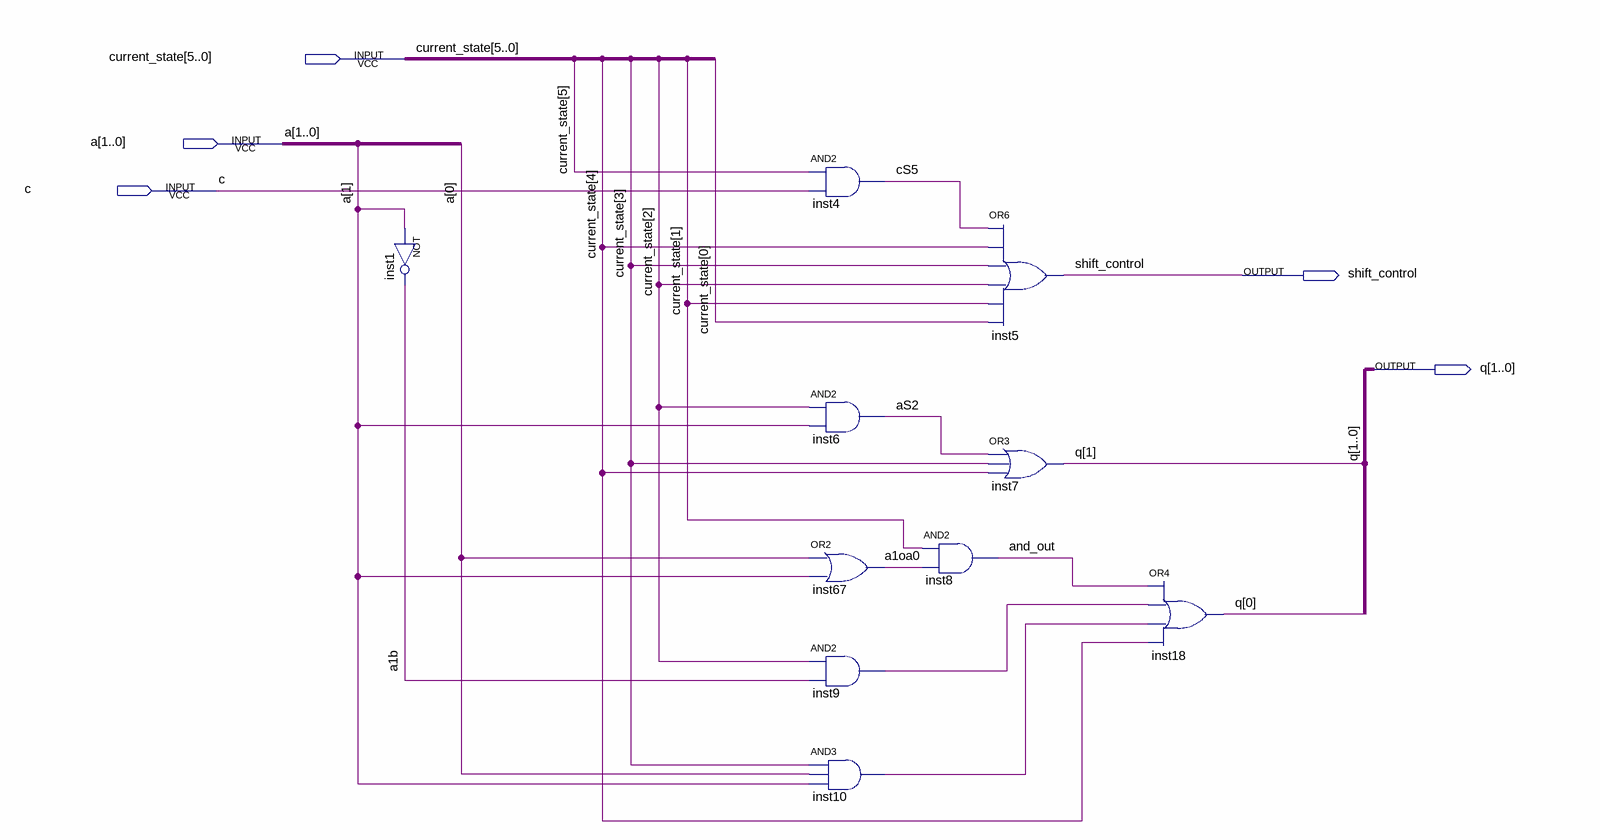
[diagram p0: schematic sheet]
// Quartus schematic Quotient_output_logic_mealy.bdf as structural Verilog: 10 symbols, 5 pins
module Quotient_output_logic_mealy (
  input  [5:0] current_state,
  input  [1:0] a,
  input  c,
  output shift_control,
  output [1:0] q
);

  wire a1b, a1oa0, and_out, aS2, cS5, inst9_out, inst10_out;

  not inst1 (a1b, a[1]);
  and inst4 (cS5, current_state[5], c);
  and inst6 (aS2, current_state[2], a[1]);
  or inst67 (a1oa0, a[0], a[1]);
  and inst9 (inst9_out, current_state[2], a1b);
  and inst10 (inst10_out, current_state[3], a[0], a[1]);
  and inst8 (and_out, current_state[1], a1oa0);
  or inst5 (shift_control, cS5, current_state[4], current_state[3], current_state[2], current_state[1], current_state[0]);
  or inst7 (q[1], aS2, current_state[3], current_state[4]);
  or inst18 (q[0], and_out, inst9_out, inst10_out, current_state[4]);
endmodule
